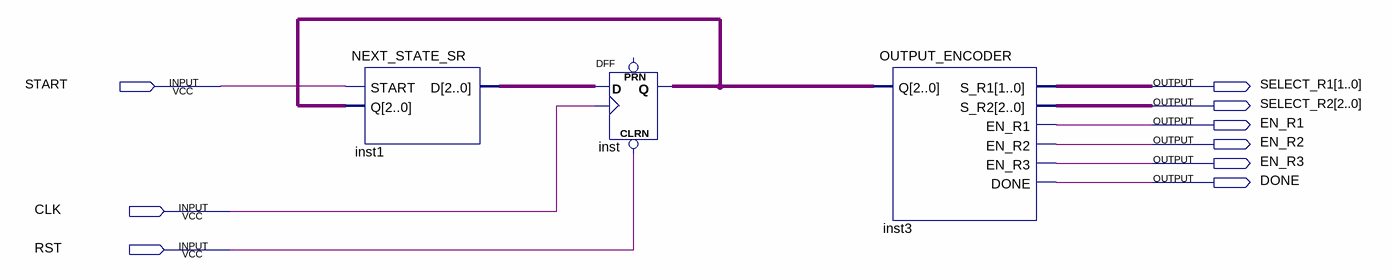
[diagram p0: schematic sheet]
// Quartus schematic CONTROLER_SR.bdf as structural Verilog: 3 symbols, 9 pins
module CONTROLER_SR (
  input  START,
  input  CLK,
  input  RST,
  output [1:0] SELECT_R1,
  output [2:0] SELECT_R2,
  output EN_R1,
  output EN_R2,
  output EN_R3,
  output DONE
);

  wire [2:0] inst1_d, inst_q;

  NEXT_STATE_SR inst1 (.START(START), .Q(inst_q), .D(inst1_d));
  DFF inst[2:0] (.CLRN(RST), .CLK(CLK), .D(inst1_d), .Q(inst_q));  // open: PRN
  OUTPUT_ENCODER inst3 (
    .Q(inst_q), .S_R1(SELECT_R1), .S_R2(SELECT_R2), .EN_R1(EN_R1), .EN_R2(EN_R2), .EN_R3(EN_R3), .DONE(DONE));
endmodule
